# Altium project F800GSDayLight.PrjPcb
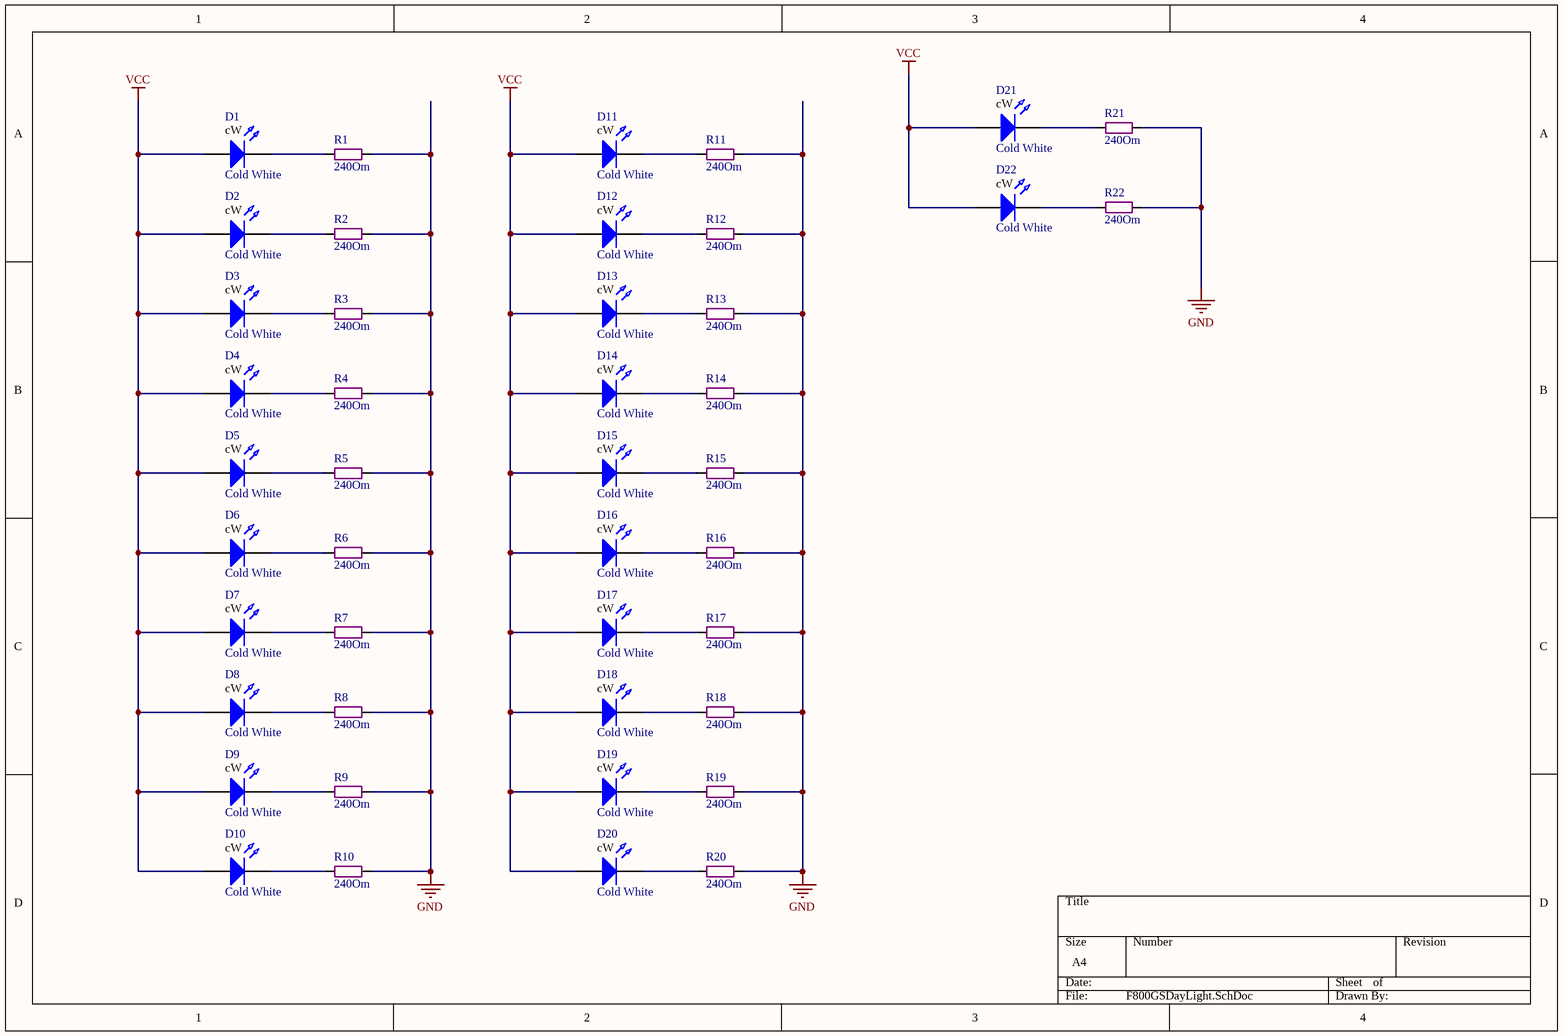
[diagram p0: F800GSDayLight.SchDoc]
1 sheet, 44 parts. Net scope: global (net labels, ports and power ports of the same name join across sheets).
Board files: F800GSDayLight_line10x230.PcbDoc, F800GSDayLight.PcbDoc, F800GSDayLight_forHeadlamp.PcbDoc

## Sheet F800GSDayLight.SchDoc
size A4

### Parts
D1  Cold White  [LED SMD 5050 White compact R]
D2  Cold White  [LED SMD 5050 White compact R]
D3  Cold White  [LED SMD 5050 White compact R]
D4  Cold White  [LED SMD 5050 White compact R]
D5  Cold White  [LED SMD 5050 White compact R]
D6  Cold White  [LED SMD 5050 White compact R]
D7  Cold White  [LED SMD 5050 White compact R]
D8  Cold White  [LED SMD 5050 White compact R]
D9  Cold White  [LED SMD 5050 White compact R]
D10  Cold White  [LED SMD 5050 White compact R]
D11  Cold White  [LED SMD 5050 White compact R]
D12  Cold White  [LED SMD 5050 White compact R]
D13  Cold White  [LED SMD 5050 White compact R]
D14  Cold White  [LED SMD 5050 White compact R]
D15  Cold White  [LED SMD 5050 White compact R]
D16  Cold White  [LED SMD 5050 White compact R]
D17  Cold White  [LED SMD 5050 White compact R]
D18  Cold White  [LED SMD 5050 White compact R]
D19  Cold White  [LED SMD 5050 White compact R]
D20  Cold White  [LED SMD 5050 White compact R]
D21  Cold White  [LED SMD 5050 White compact R]
D22  Cold White  [LED SMD 5050 White compact R]
R1  240Om  [SMD 0805 (2012)]
R2  240Om  [SMD 0805 (2012)]
R3  240Om  [SMD 0805 (2012)]
R4  240Om  [SMD 0805 (2012)]
R5  240Om  [SMD 0805 (2012)]
R6  240Om  [SMD 0805 (2012)]
R7  240Om  [SMD 0805 (2012)]
R8  240Om  [SMD 0805 (2012)]
R9  240Om  [SMD 0805 (2012)]
R10  240Om  [SMD 0805 (2012)]
R11  240Om  [SMD 0805 (2012)]
R12  240Om  [SMD 0805 (2012)]
R13  240Om  [SMD 0805 (2012)]
R14  240Om  [SMD 0805 (2012)]
R15  240Om  [SMD 0805 (2012)]
R16  240Om  [SMD 0805 (2012)]
R17  240Om  [SMD 0805 (2012)]
R18  240Om  [SMD 0805 (2012)]
R19  240Om  [SMD 0805 (2012)]
R20  240Om  [SMD 0805 (2012)]
R21  240Om  [SMD 0805 (2012)]
R22  240Om  [SMD 0805 (2012)]

### Nets
GND: R1.2 R2.2 R3.2 R4.2 R5.2 R6.2 R7.2 R8.2 R9.2 R10.2 R11.2 R12.2 R13.2 R14.2 R15.2 R16.2 R17.2 R18.2 R19.2 R20.2 R21.2 R22.2
VCC: D1.A D2.A D3.A D4.A D5.A D6.A D7.A D8.A D9.A D10.A D11.A D12.A D13.A D14.A D15.A D16.A D17.A D18.A D19.A D20.A D21.A D22.A
NetD1_K: D1.K R1.1
NetD2_K: D2.K R2.1
NetD3_K: D3.K R3.1
NetD4_K: D4.K R4.1
NetD5_K: D5.K R5.1
NetD6_K: D6.K R6.1
NetD7_K: D7.K R7.1
NetD8_K: D8.K R8.1
NetD9_K: D9.K R9.1
NetD10_K: D10.K R10.1
NetD11_K: D11.K R11.1
NetD12_K: D12.K R12.1
NetD13_K: D13.K R13.1
NetD14_K: D14.K R14.1
NetD15_K: D15.K R15.1
NetD16_K: D16.K R16.1
NetD17_K: D17.K R17.1
NetD18_K: D18.K R18.1
NetD19_K: D19.K R19.1
NetD20_K: D20.K R20.1
NetD21_K: D21.K R21.1
NetD22_K: D22.K R22.1

### Notes on the sheet
- (in symbol Led SMD White Cold) cW

### Library data of the parts
D1-D22 = Led SMD White Cold: ?3v ?20mA; Forward Voltage TYP: ?3; Resistor for 5v VCC: 240 Om; Forward Voltage Min: ?; Wave len min/typ: ?; Liminous Min (mcd): ?; Liminous Typ (mcd): ?; Forward Amp (mA): ?; Color: Cold White
R1-R22 = Res All Types